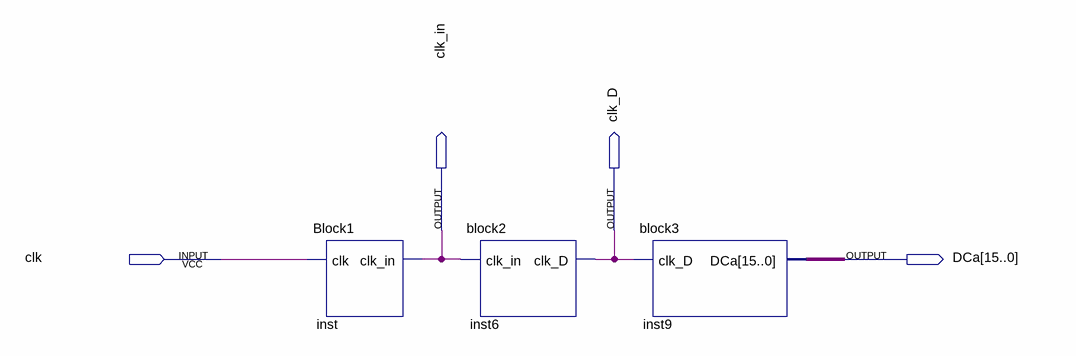
[diagram p0: schematic sheet]
// Quartus schematic main.bdf as structural Verilog: 3 symbols, 4 pins
module main (
  input  clk,
  output clk_in,
  output clk_D,
  output [15:0] DCa
);

  Block1 inst (.clk(clk), .clk_in(clk_in));
  block2 inst6 (.clk_in(clk_in), .clk_D(clk_D));
  block3 inst9 (.clk_D(clk_D), .DCa(DCa));
endmodule
